# Altium schematic sheet STM32H730_PINOUT.SchDoc
size D; SheetNumber: 5; SheetTotal: 5
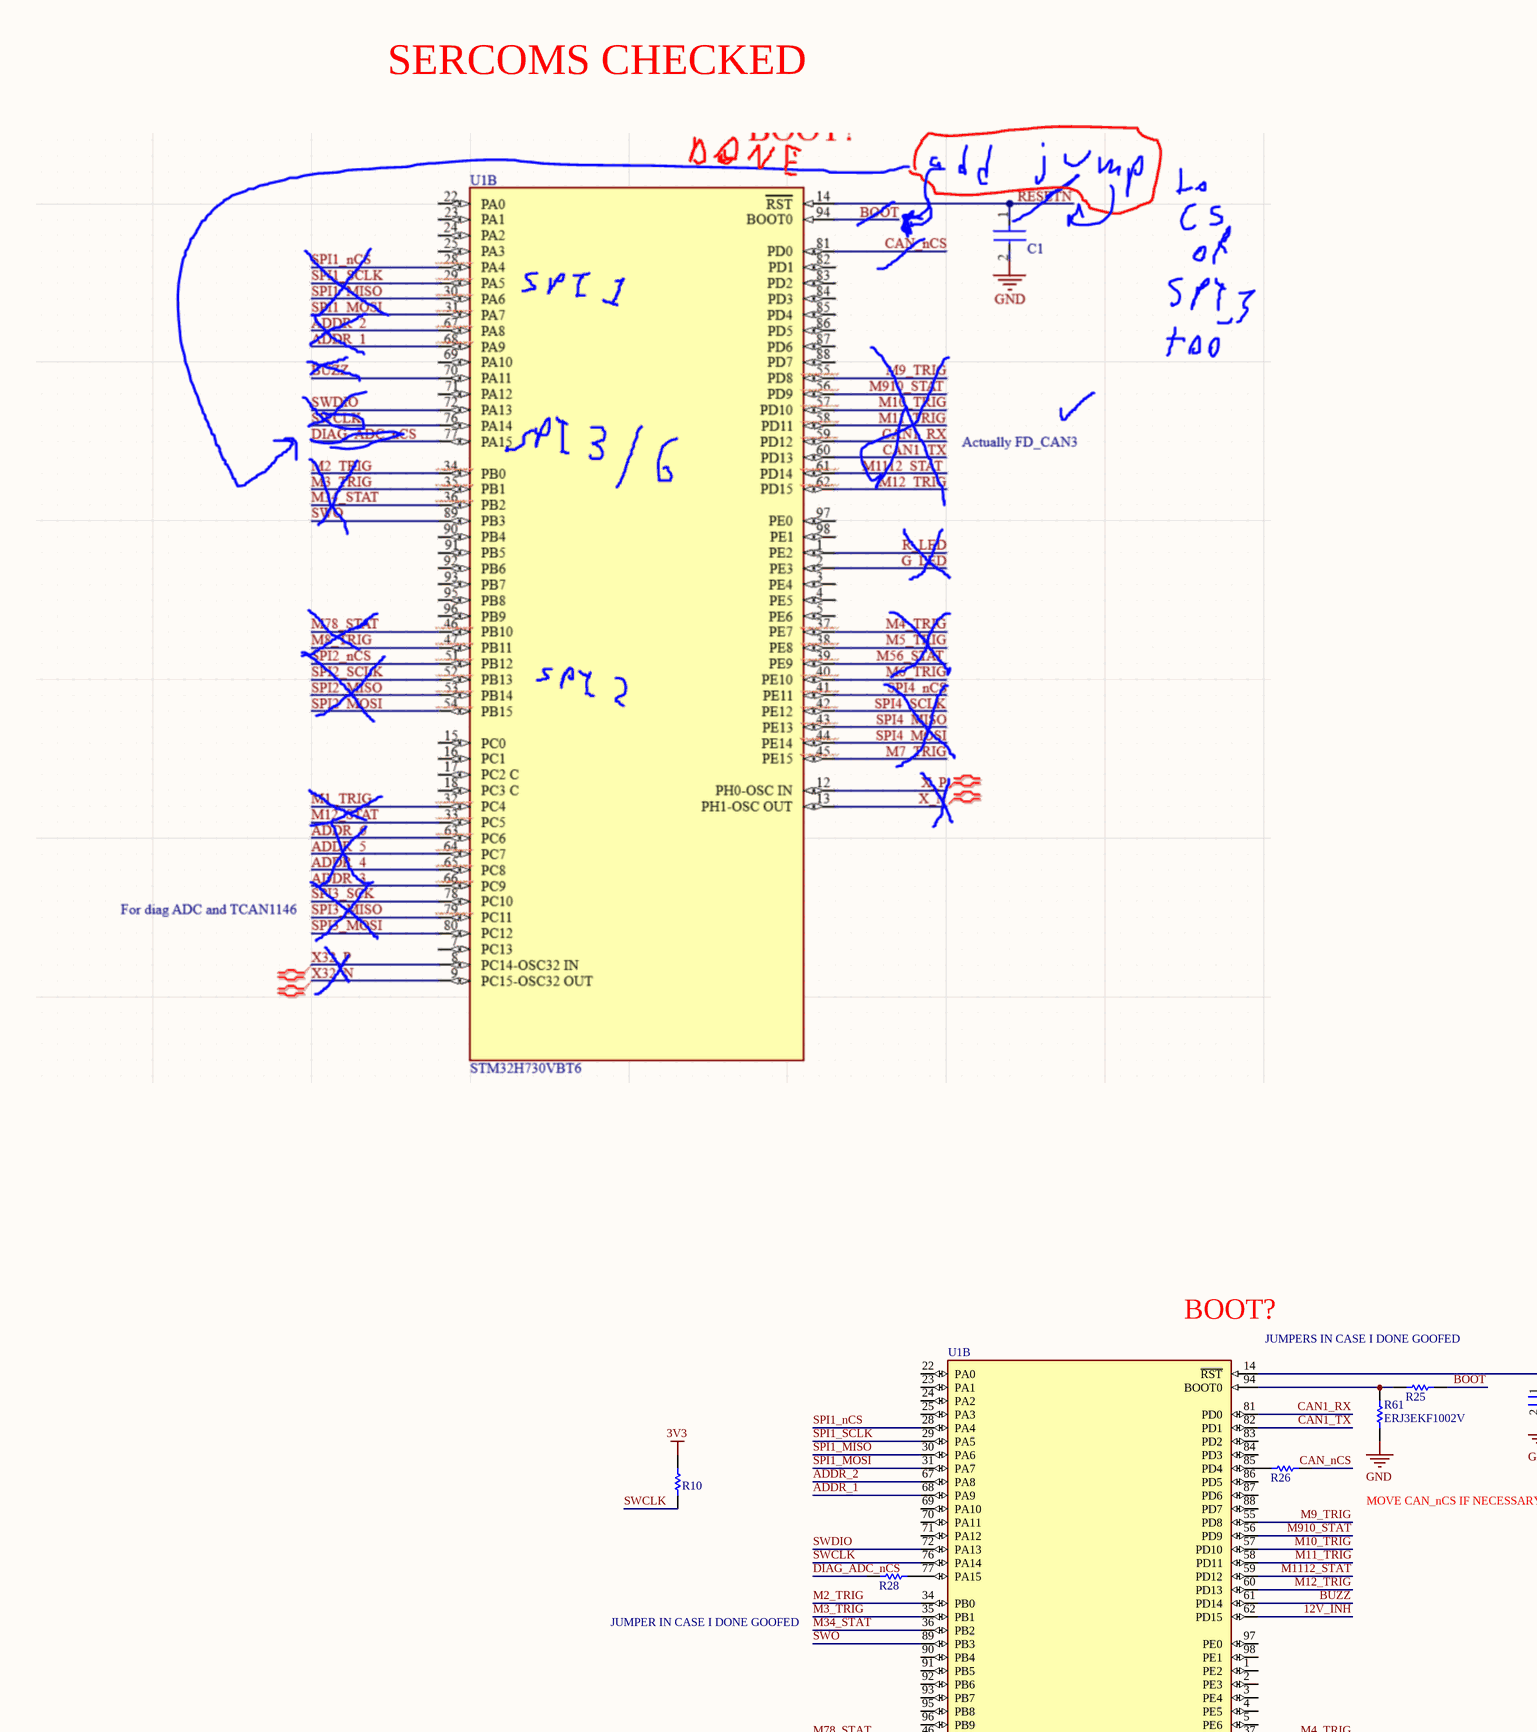
[diagram p0: STM32H730_PINOUT.SchDoc, top left]
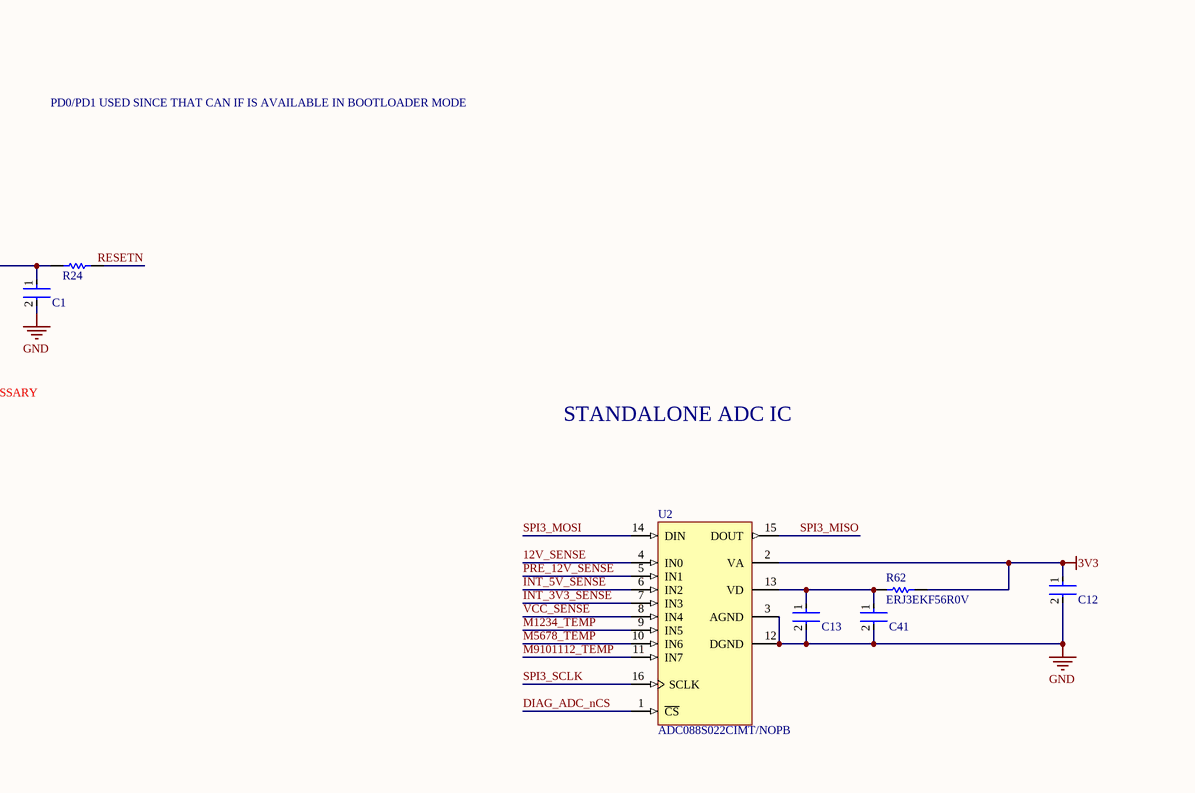
[diagram p1: STM32H730_PINOUT.SchDoc, top middle]
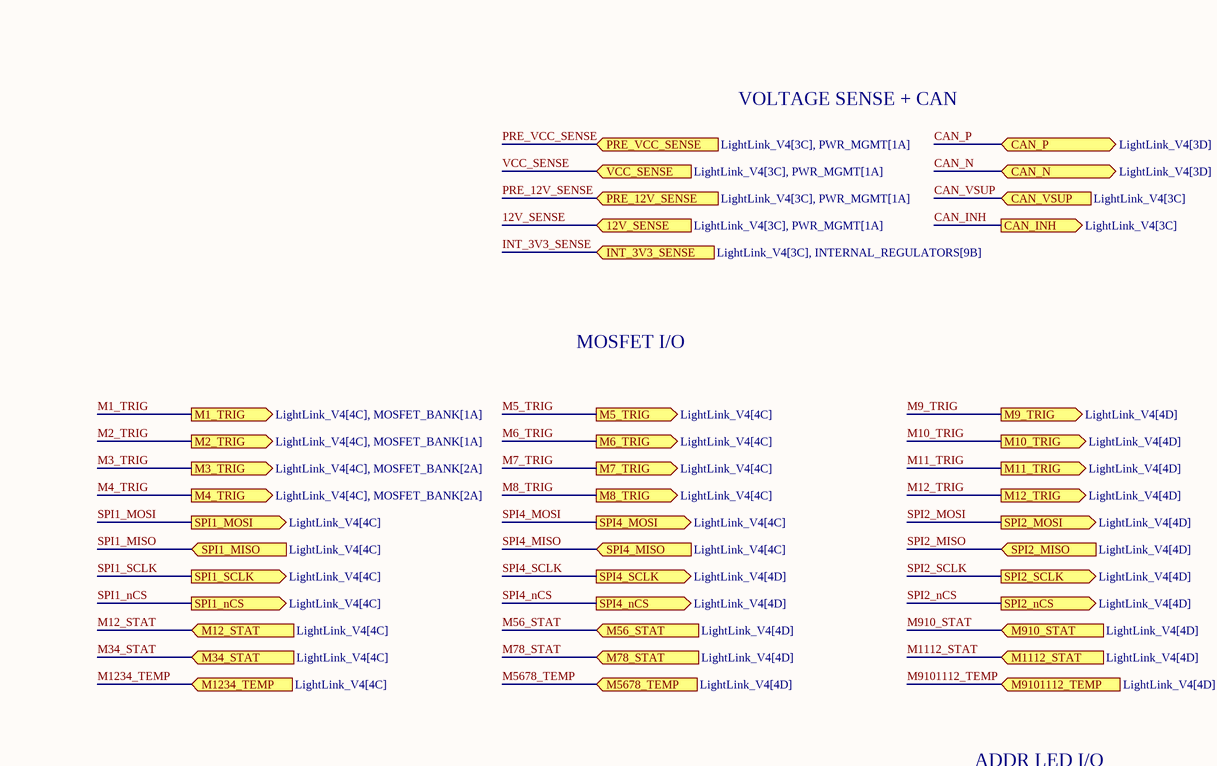
[diagram p2: STM32H730_PINOUT.SchDoc, top right]
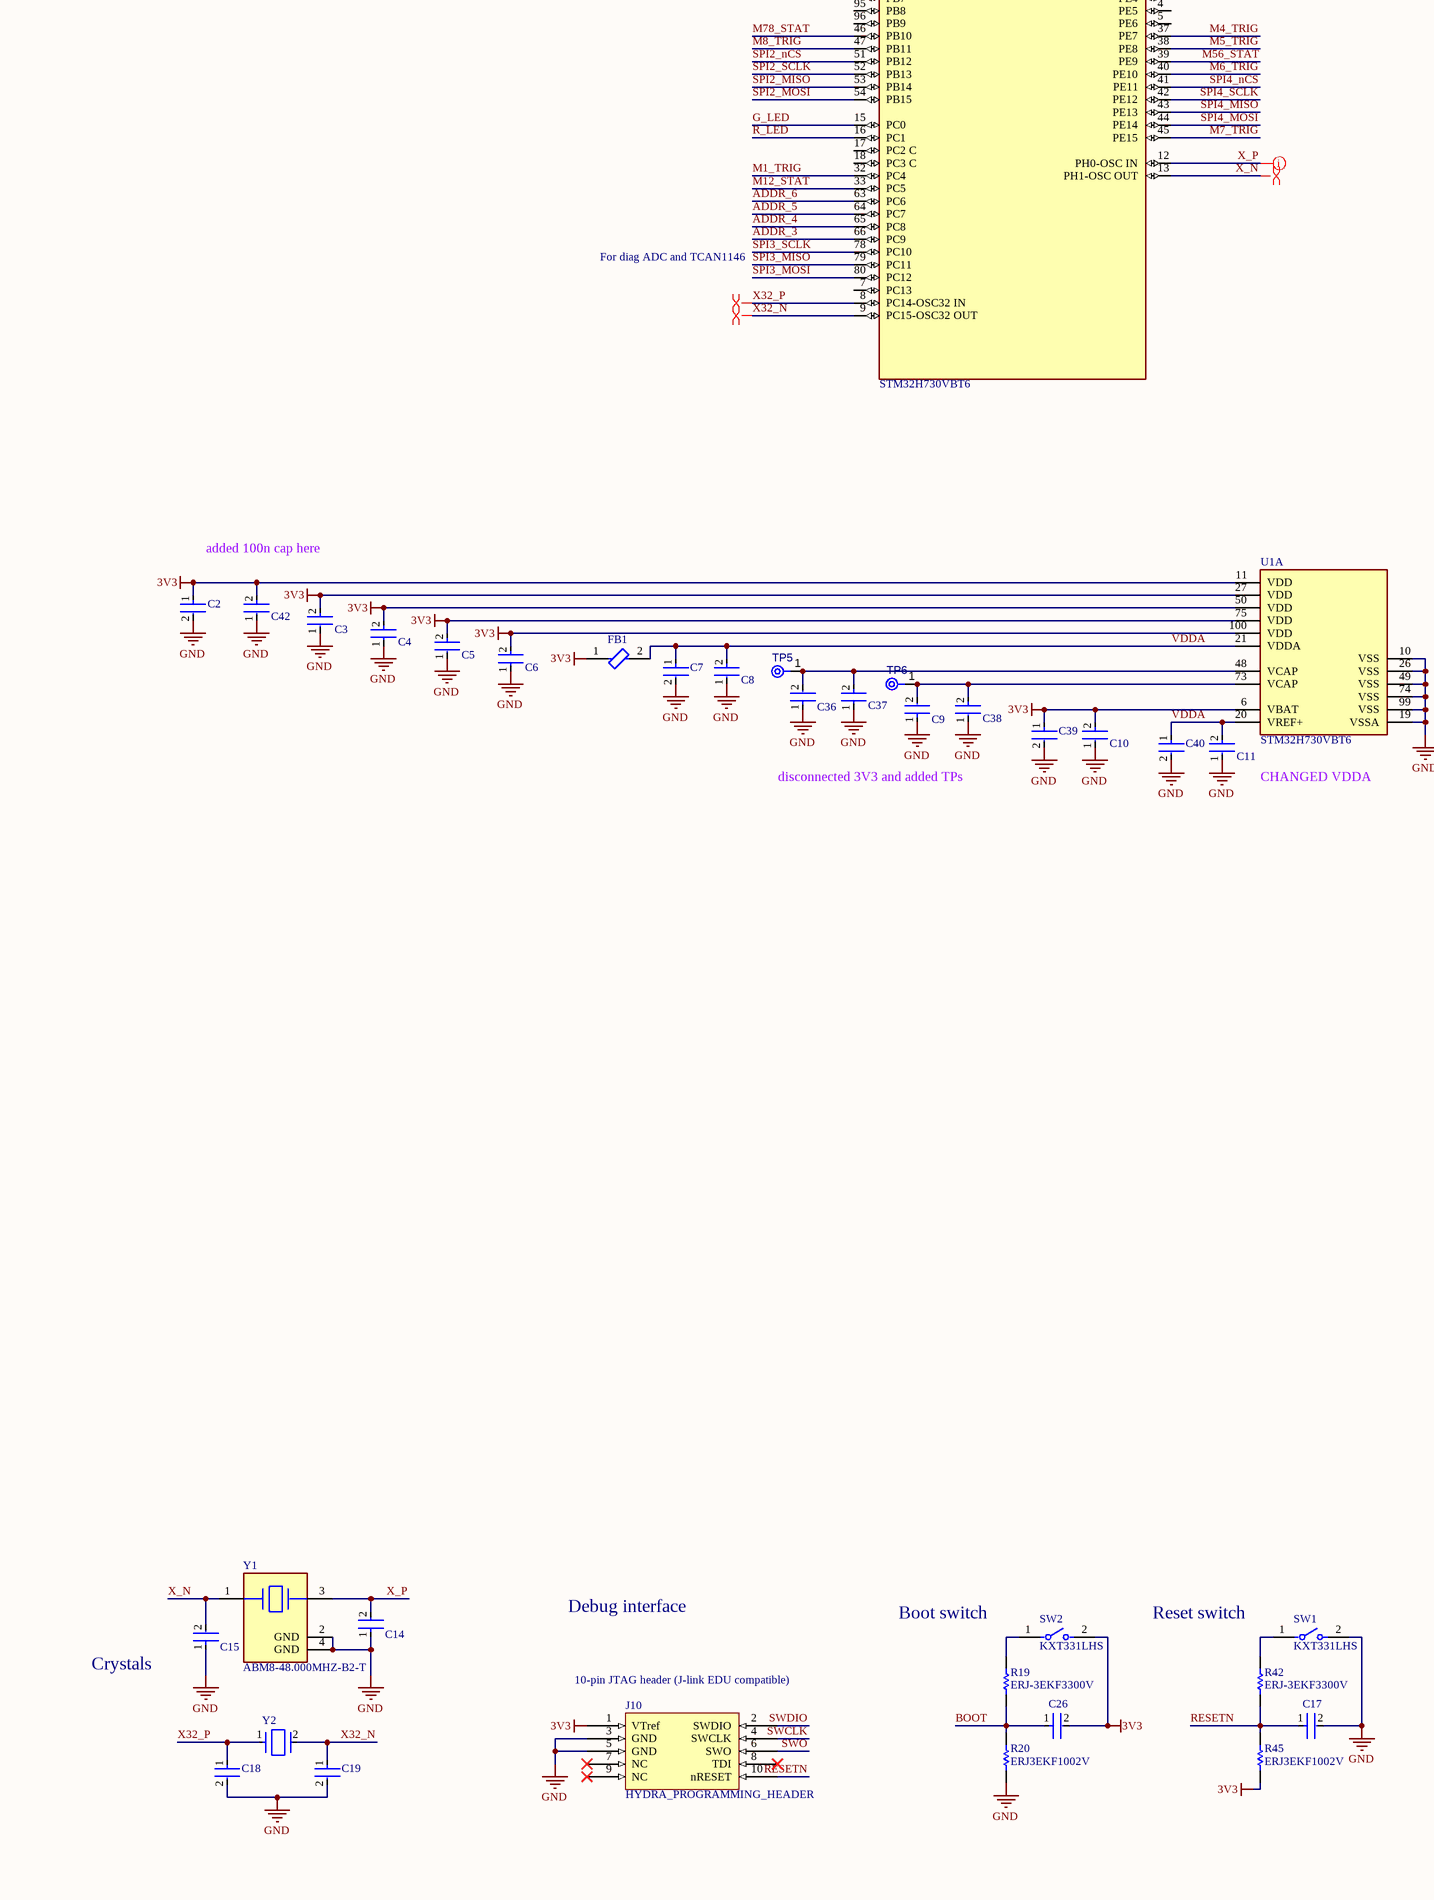
[diagram p3: STM32H730_PINOUT.SchDoc, bottom left]
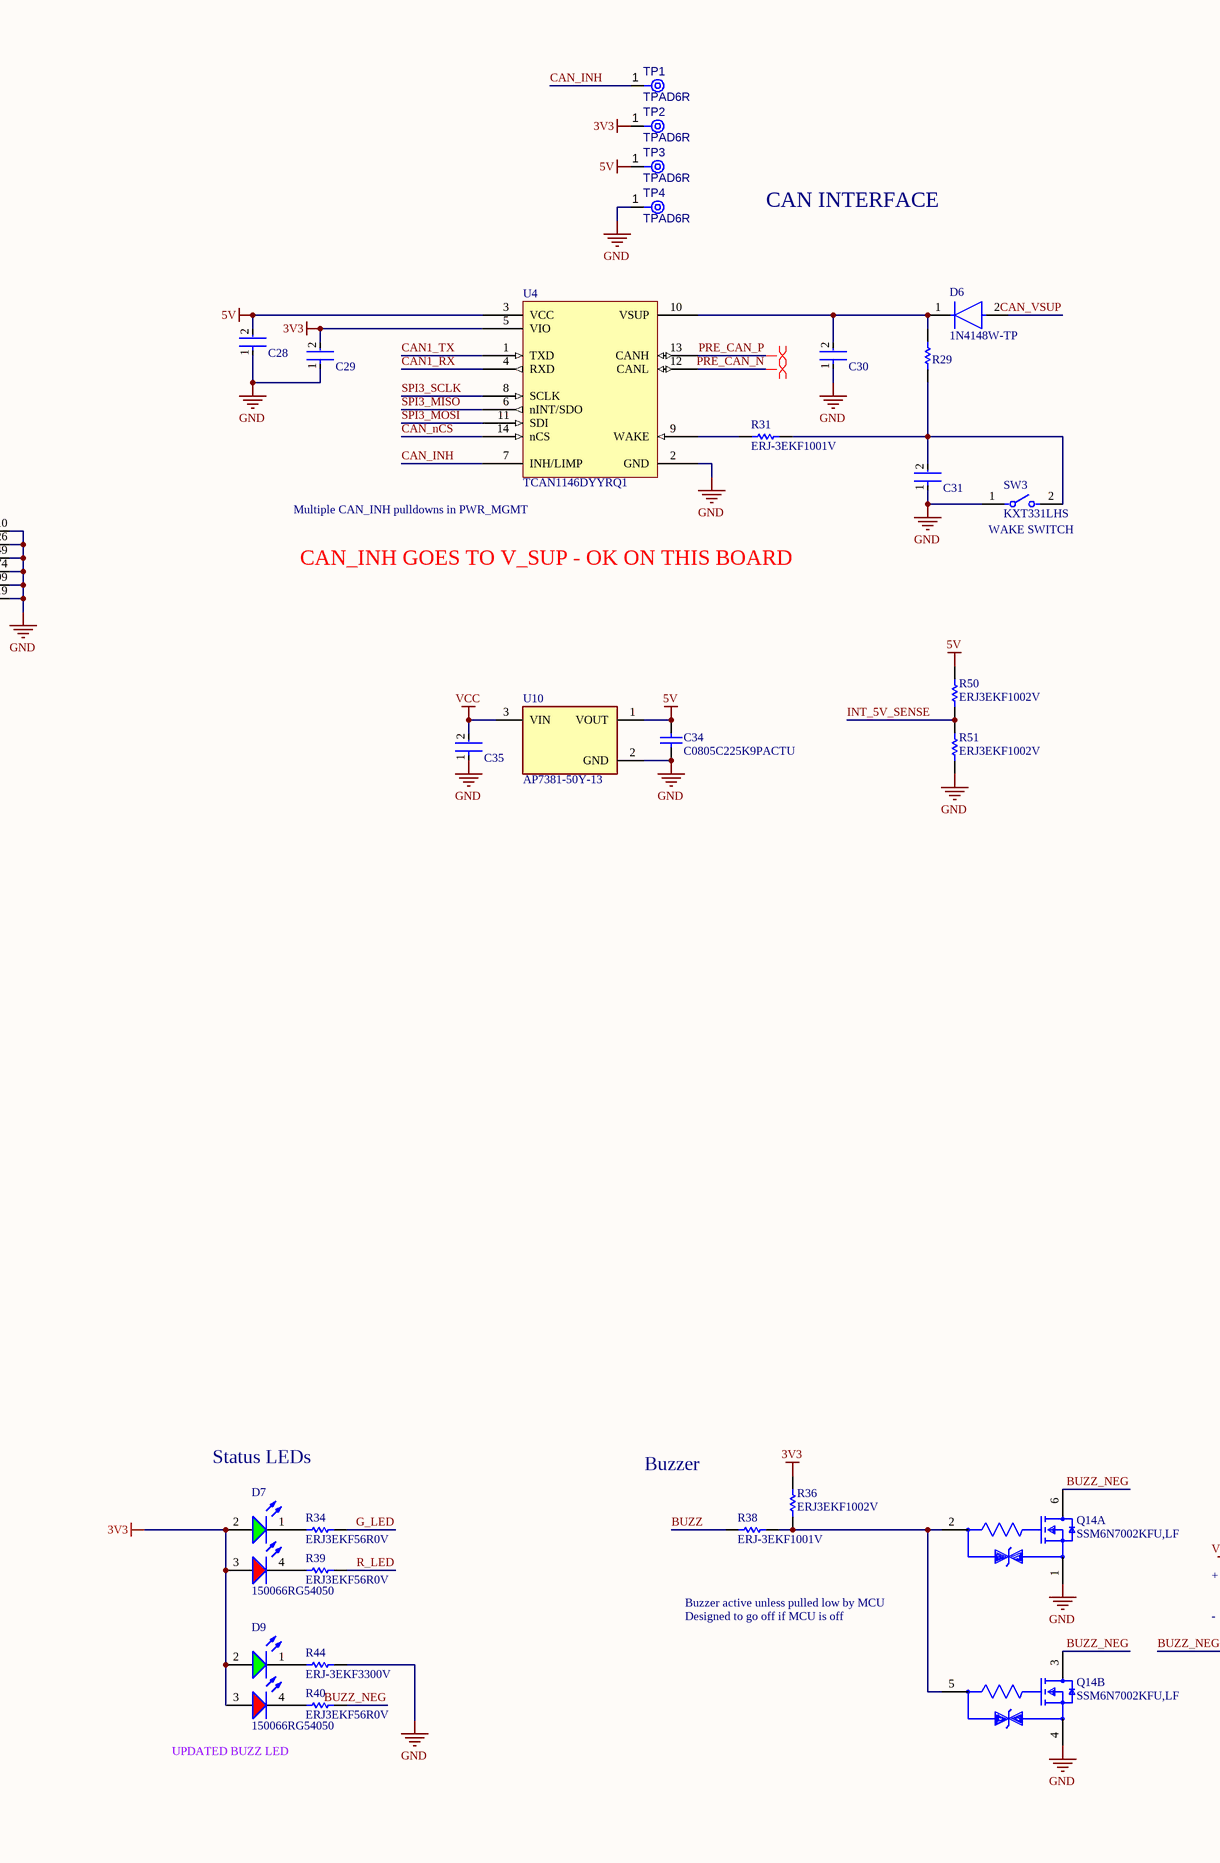
[diagram p4: STM32H730_PINOUT.SchDoc, bottom middle]
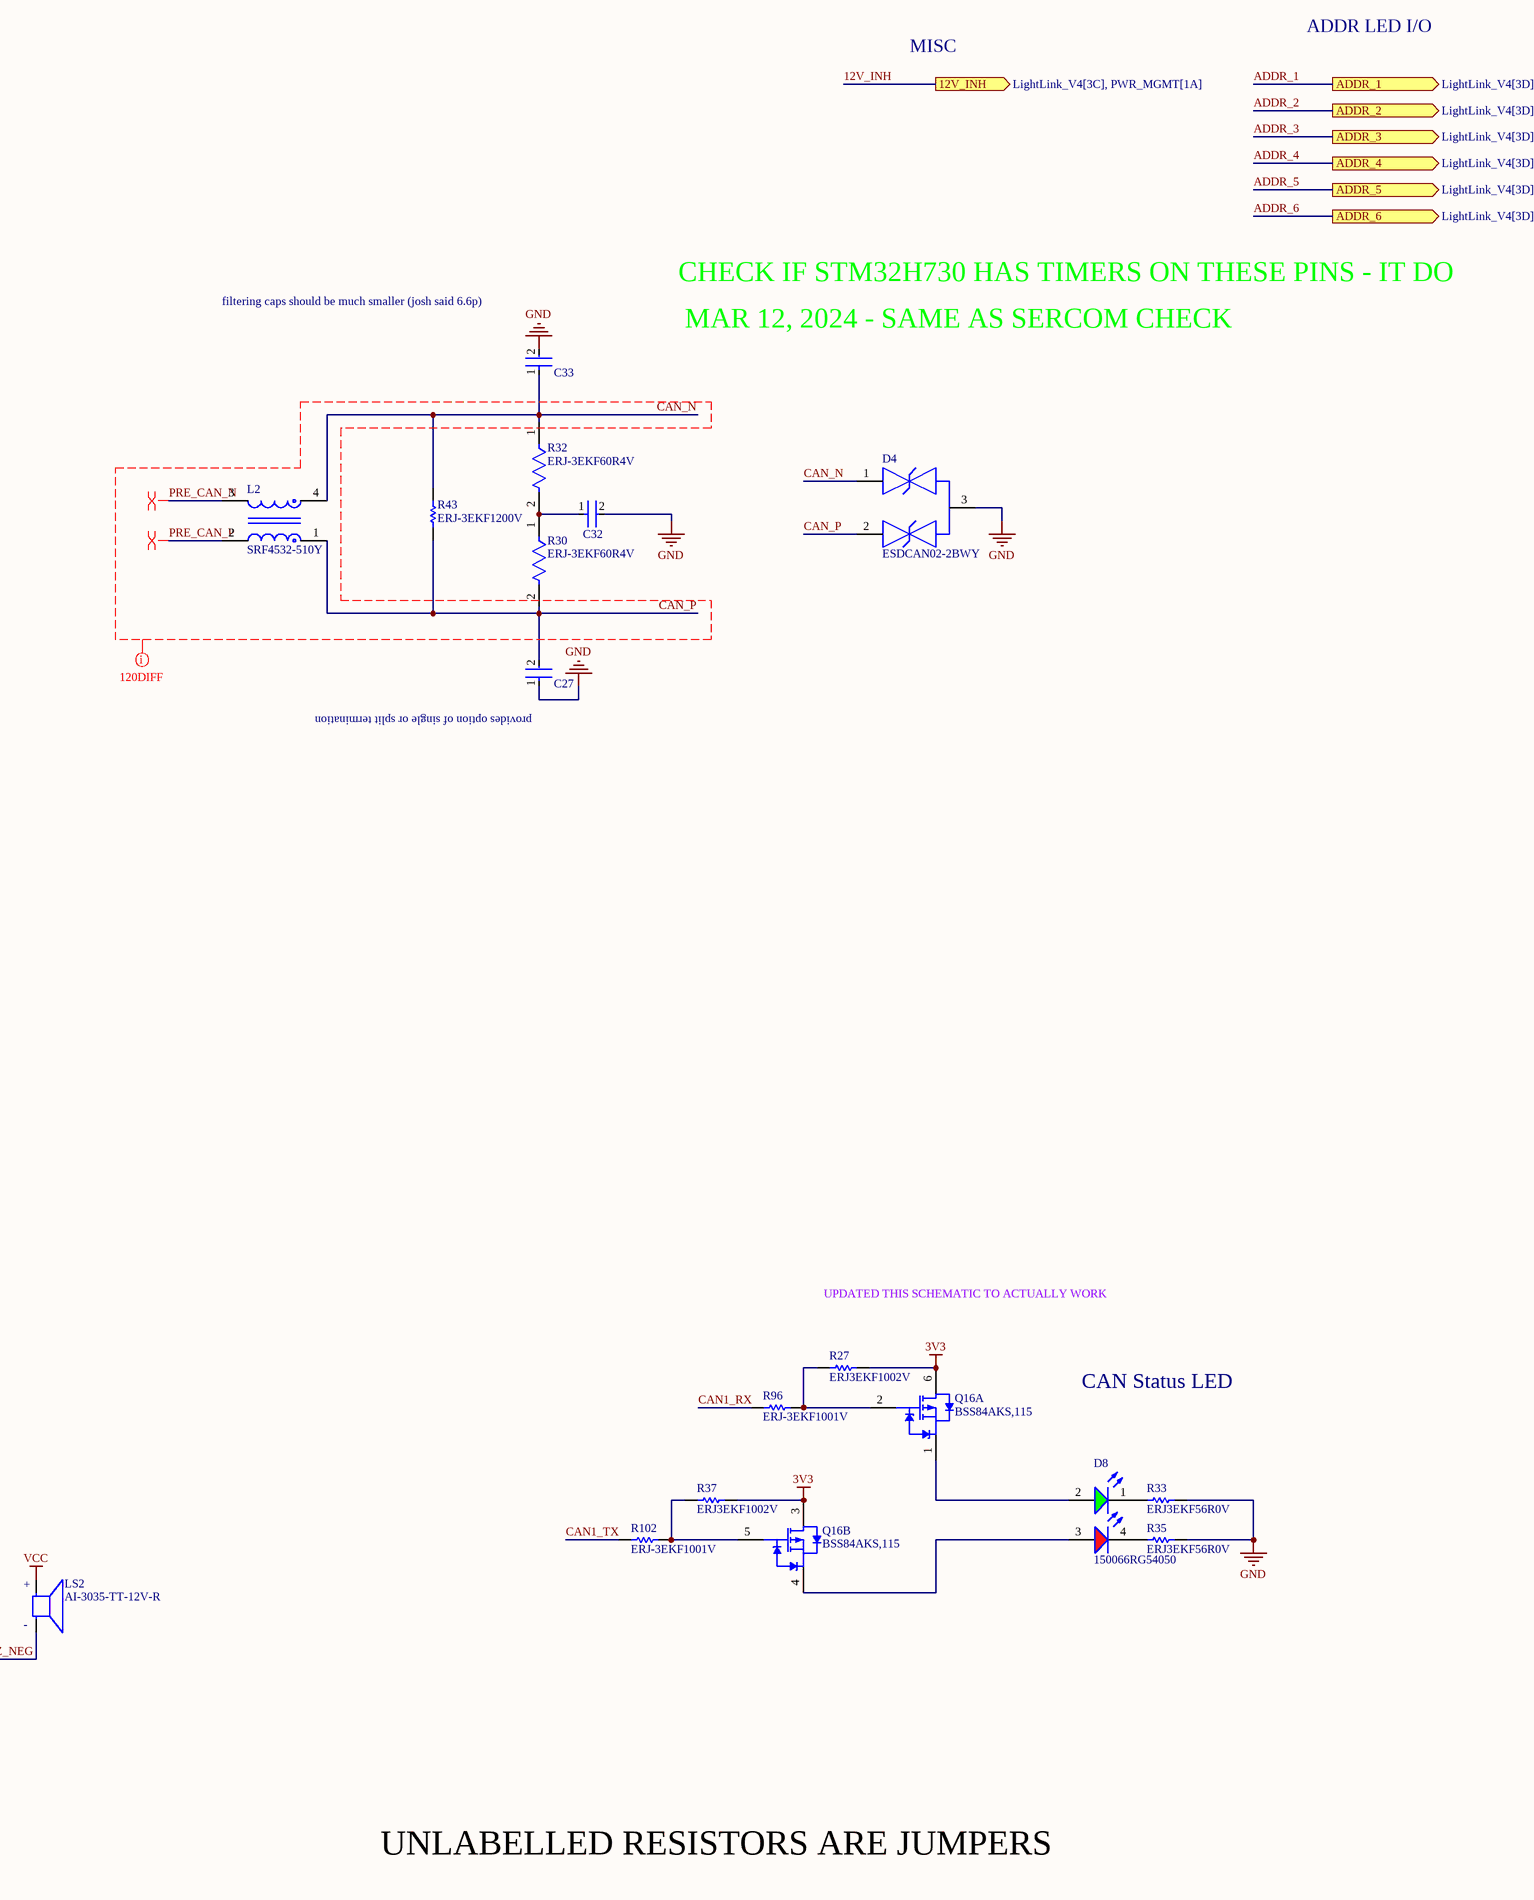
[diagram p5: STM32H730_PINOUT.SchDoc, bottom right]

## Parts
C1  C0402C104K8PACTU  [FP-C0402-BB-MFG]  (value not drawn)
C2  C1005X5R1A475K050BC  [FP-C1005-050-0_15-MFG]  (value not drawn)
C3  GRM155R71C104KA88D  [FP-GRM15-MFG]  (value not drawn)
C4  GRM155R71C104KA88D  [FP-GRM15-MFG]  (value not drawn)
C5  GRM155R71C104KA88D  [FP-GRM15-MFG]  (value not drawn)
C6  GRM155R71C104KA88D  [FP-GRM15-MFG]  (value not drawn)
C7  EMK105BJ105KV-F  [FP-0402-L_1_0_0_05-W_0_5-IPC_A]  (value not drawn)
C8  GRM155R71C104KA88D  [FP-GRM15-MFG]  (value not drawn)
C9  C1005X7S1A225K050BC  [FP-C1005-050-0_15-0_1-MFG]  (value not drawn)
C10  GRM155R71C104KA88D  [FP-GRM15-MFG]  (value not drawn)
C11  GRM155R71C104KA88D  [FP-GRM15-MFG]  (value not drawn)
C12  C0402C104K8PACTU  [FP-C0402-BB-MFG]  (value not drawn)
C13  C0402C104K8PACTU  [FP-C0402-BB-MFG]  (value not drawn)
C14  08051A6R8CAT2A  [FP-0805-L_2_01_0_2-W_1_25-MFG]  (value not drawn)
C15  08051A6R8CAT2A  [FP-0805-L_2_01_0_2-W_1_25-MFG]  (value not drawn)
C17  C0402C104K8PACTU  [FP-C0402-BB-MFG]  (value not drawn)
C18  C0805C180J5GACTU  [FP-C0805C-DN-MFG]  (value not drawn)
C19  C0805C180J5GACTU  [FP-C0805C-DN-MFG]  (value not drawn)
C26  C0402C104K8PACTU  [FP-C0402-BB-MFG]  (value not drawn)
C27  C0402C104K8PACTU  [FP-C0402-BB-MFG]  (value not drawn)
C28  C0402C104K8PACTU  [FP-C0402-BB-MFG]  (value not drawn)
C29  C0402C104K8PACTU  [FP-C0402-BB-MFG]  (value not drawn)
C30  C0402C104K8PACTU  [FP-C0402-BB-MFG]  (value not drawn)
C31  C0402C104K8PACTU  [FP-C0402-BB-MFG]  (value not drawn)
C32  C0402C104K8PACTU  [FP-C0402-BB-MFG]  (value not drawn)
C33  C0402C104K8PACTU  [FP-C0402-BB-MFG]  (value not drawn)
C34  C0805C225K9PACTU  [CAPC2013X145X50ML20T25]
C35  C0402C104K8PACTU  [FP-C0402-BB-MFG]  (value not drawn)
C36  C1005X7S1A225K050BC  [FP-C1005-050-0_15-0_1-MFG]  (value not drawn)
C37  GRM155R71C104KA88D  [FP-GRM15-MFG]  (value not drawn)
C38  GRM155R71C104KA88D  [FP-GRM15-MFG]  (value not drawn)
C39  EMK105BJ105KV-F  [FP-0402-L_1_0_0_05-W_0_5-IPC_A]  (value not drawn)
C40  EMK105BJ105KV-F  [FP-0402-L_1_0_0_05-W_0_5-IPC_A]  (value not drawn)
C41  C0402C104K8PACTU  [FP-C0402-BB-MFG]  (value not drawn)
C42  GRM155R71C104KA88D  [FP-GRM15-MFG]  (value not drawn)
D4  ESDCAN02-2BWY  [FP-SOT323-3L-MFG]
D6  1N4148W-TP  [FP-SOD-123-IPC_A]
D7  150066RG54050  [WL-SBCD_0606]
D8  150066RG54050  [WL-SBCD_0606]
D9  150066RG54050  [WL-SBCD_0606]
FB1  BLM15PX601SN1D  [FP-BLM15-0_05-MFG]  (value not drawn)
J10  HYDRA_PROGRAMMING_HEADER  [3220-10-0300-00-Footprint-1]
L2  SRF4532-510Y  [FP-SRF4532-MFG]
LS2  AI-3035-TT-12V-R  [AI-3035-TT-12V-R-Footprint-1]
Q14  SSM6N7002KFU,LF  [FP-SSOP6-P-0_65A-MFG]  (parts A,B of 2)
Q16  BSS84AKS,115  [NXP-SOT363_L]  (parts A,B of 2)
R10  ERJ3EKF1002V  [RESC1609X55X30LL15T15]  (value not drawn)
R19  ERJ-3EKF3300V  [RESC1608X55X30LL15T15]
R20  ERJ3EKF1002V  [RESC1609X55X30LL15T15]
R24  0402 JUMPER 0 OHM  [RESC1005X40X25NL05T05]  (value not drawn)
R25  0402 JUMPER 0 OHM  [RESC1005X40X25NL05T05]  (value not drawn)
R26  0402 JUMPER 0 OHM  [RESC1005X40X25NL05T05]  (value not drawn)
R27  ERJ3EKF1002V  [RESC1609X55X30LL15T15]
R28  0402 JUMPER 0 OHM  [RESC1005X40X25NL05T05]  (value not drawn)
R29  ERJ3EKF1002V  [RESC1609X55X30LL15T15]  (value not drawn)
R30  ERJ-3EKF60R4V  [FP-ERJ3EK-IPC_C]
R31  ERJ-3EKF1001V  [RESC1608X55X30LL15T15]
R32  ERJ-3EKF60R4V  [FP-ERJ3EK-IPC_C]
R33  ERJ3EKF56R0V  [RESC1608X55X30NL15T15]
R34  ERJ3EKF56R0V  [RESC1608X55X30NL15T15]
R35  ERJ3EKF56R0V  [RESC1608X55X30NL15T15]
R36  ERJ3EKF1002V  [RESC1609X55X30LL15T15]
R37  ERJ3EKF1002V  [RESC1609X55X30LL15T15]
R38  ERJ-3EKF1001V  [RESC1608X55X30LL15T15]
R39  ERJ3EKF56R0V  [RESC1608X55X30NL15T15]
R40  ERJ3EKF56R0V  [RESC1608X55X30NL15T15]
R42  ERJ-3EKF3300V  [RESC1608X55X30LL15T15]
R43  ERJ-3EKF1200V  [RESC1609X55X30ML15T15]
R44  ERJ-3EKF3300V  [RESC1608X55X30LL15T15]
R45  ERJ3EKF1002V  [RESC1609X55X30LL15T15]
R50  ERJ3EKF1002V  [RESC1609X55X30LL15T15]
R51  ERJ3EKF1002V  [RESC1609X55X30LL15T15]
R61  ERJ3EKF1002V  [RESC1609X55X30LL15T15]
R62  ERJ3EKF56R0V  [RESC1608X55X30NL15T15]
R96  ERJ-3EKF1001V  [RESC1608X55X30LL15T15]
R102  ERJ-3EKF1001V  [RESC1608X55X30LL15T15]
SW1  KXT331LHS  [FP-KXT331LHS-MFG]
SW2  KXT331LHS  [FP-KXT331LHS-MFG]
SW3  KXT331LHS  [FP-KXT331LHS-MFG]
TP1  TPAD6R  [TP06R]  (no BOM)
TP2  TPAD6R  [TP06R]  (no BOM)
TP3  TPAD6R  [TP06R]  (no BOM)
TP4  TPAD6R  [TP06R]  (no BOM)
TP5  TPAD6R  [TP06R]  (value not drawn)  (no BOM)
TP6  TPAD6R  [TP06R]  (value not drawn)  (no BOM)
U1  STM32H730VBT6  [FP-LQFP100-1L-IPC_C]  (parts A,B of 2)
U2  ADC088S022CIMT/NOPB  [MTC16_L]
U4  TCAN1146DYYRQ1  [TCAN1146DYYRQ1-Footprint-1]
U10  AP7381-50Y-13  [FP-SOT89-MFG]
Y1  ABM8-48.000MHZ-B2-T  [FP-ABM8-MFG]
Y2  ECS-.327-12.5-1210-TR  [FP-ECX-1210-MFG]  (value not drawn)

## Ports
12V_INH (out, see LightLink_V4[3C], PWR_MGMT[1A]), 12V_SENSE (in, see LightLink_V4[3C], PWR_MGMT[1A]), ADDR_1 (out, see LightLink_V4[3D]), ADDR_2 (out, see LightLink_V4[3D]), ADDR_3 (out, see LightLink_V4[3D]), ADDR_4 (out, see LightLink_V4[3D]), ADDR_5 (out, see LightLink_V4[3D]), ADDR_6 (out, see LightLink_V4[3D]), CAN_INH (out, see LightLink_V4[3C]), CAN_N (bidir, see LightLink_V4[3D]), CAN_P (bidir, see LightLink_V4[3D]), CAN_VSUP (in, see LightLink_V4[3C]), INT_3V3_SENSE (in, see LightLink_V4[3C], INTERNAL_REGULATORS[9B]), M1_TRIG (out, see LightLink_V4[4C], MOSFET_BANK[1A]), M2_TRIG (out, see LightLink_V4[4C], MOSFET_BANK[1A]), M3_TRIG (out, see LightLink_V4[4C], MOSFET_BANK[2A]), M4_TRIG (out, see LightLink_V4[4C], MOSFET_BANK[2A]), M5_TRIG (out, see LightLink_V4[4C]), M6_TRIG (out, see LightLink_V4[4C]), M7_TRIG (out, see LightLink_V4[4C]), M8_TRIG (out, see LightLink_V4[4C]), M9_TRIG (out, see LightLink_V4[4D]), M10_TRIG (out, see LightLink_V4[4D]), M11_TRIG (out, see LightLink_V4[4D]), M12_STAT (in, see LightLink_V4[4C]), M12_TRIG (out, see LightLink_V4[4D]), M34_STAT (in, see LightLink_V4[4C]), M56_STAT (in, see LightLink_V4[4D]), M78_STAT (in, see LightLink_V4[4D]), M910_STAT (in, see LightLink_V4[4D]), M1112_STAT (in, see LightLink_V4[4D]), M1234_TEMP (in, see LightLink_V4[4C]), M5678_TEMP (in, see LightLink_V4[4D]), M9101112_TEMP (in, see LightLink_V4[4D]), PRE_12V_SENSE (in, see LightLink_V4[3C], PWR_MGMT[1A]), PRE_VCC_SENSE (in, see LightLink_V4[3C], PWR_MGMT[1A]), SPI1_MISO (in, see LightLink_V4[4C]), SPI1_MOSI (out, see LightLink_V4[4C]), SPI1_nCS (out, see LightLink_V4[4C]), SPI1_SCLK (out, see LightLink_V4[4C]), SPI2_MISO (in, see LightLink_V4[4D]), SPI2_MOSI (out, see LightLink_V4[4D]), SPI2_nCS (out, see LightLink_V4[4D]), SPI2_SCLK (out, see LightLink_V4[4D]), SPI4_MISO (in, see LightLink_V4[4C]), SPI4_MOSI (out, see LightLink_V4[4C]), SPI4_nCS (out, see LightLink_V4[4D]), SPI4_SCLK (out, see LightLink_V4[4D]), VCC_SENSE (in, see LightLink_V4[3C], PWR_MGMT[1A])

## Nets
3V3: C2.1 C3.2 C4.2 C5.2 C6.2 C10.2 C12.1 C26.2 C29.2 C39.1 C42.2 D7.2(A) D7.3(A) D9.2(A) D9.3(A) FB1.1 J10.1(VTref) Q16.3(D2) Q16.6(D1) R10.1 R27.2 R36.2 R37.2 R45.1 R62.1 SW2.2 TP2.1(TP) U1.6(VBAT) U1.11(VDD) U1.27(VDD) U1.50(VDD) U1.75(VDD) U1.100(VDD) U2.2(VA) U4.5(VIO)
5V: C28.2 C34.2 R50.2 TP3.1(TP) U4.3(VCC) U10.1(VOUT)
GND: C1.2 C2.2 C3.1 C4.1 C5.1 C6.1 C7.2 C8.1 C9.1 C10.1 C11.1 C12.2 C13.2 C14.1 C15.1 C17.2 C18.2 C19.2 C27.1 C28.1 C29.1 C30.1 C31.1 C32.2 C33.2 C34.1 C35.1 C36.1 C37.1 C38.1 C39.2 C40.2 C41.2 C42.1 D4.3 J10.3(GND) J10.5(GND) Q14.1(Source1) Q14.4(Source2) R20.1 R33.1 R35.1 R44.2 R51.2 R61.1 SW1.2 SW3.1 TP4.1(TP) U1.10(VSS) U1.19(VSSA) U1.26(VSS) U1.49(VSS) U1.74(VSS) U1.99(VSS) U2.3(AGND) U2.12(DGND) U4.2(GND) U10.2(GND) Y1.2(GND) Y1.4(GND)
VCC: C35.2 LS2.P U10.3(VIN)
12V_INH: U1.62(PD15) ; port 12V_INH
12V_SENSE: U2.4(IN0) ; port 12V_SENSE
ADDR_1: U1.68(PA9) ; port ADDR_1
ADDR_2: U1.67(PA8) ; port ADDR_2
ADDR_3: U1.66(PC9) ; port ADDR_3
ADDR_4: U1.65(PC8) ; port ADDR_4
ADDR_5: U1.64(PC7) ; port ADDR_5
ADDR_6: U1.63(PC6) ; port ADDR_6
BOOT: C26.1 R19.1 R20.2 R25.2
BUZZ: R38.1 U1.61(PD14)
BUZZ_NEG: LS2.N Q14.3(Drain2) Q14.6(Drain1) R40.1
CAN1_RX: R96.1 U1.81(PD0) U4.4(RXD)
CAN1_TX: R102.1 U1.82(PD1) U4.1(TXD)
CAN_INH: TP1.1(TP) U4.7(INH/LIMP) ; port CAN_INH
CAN_N: C33.1 D4.1 L2.4 R32.1 R43.1 ; port CAN_N
CAN_nCS: R26.2 U4.14(nCS)
CAN_P: C27.2 D4.2 L2.1 R30.2 R43.2 ; port CAN_P
CAN_VSUP: D6.2(A) ; port CAN_VSUP
DIAG_ADC_nCS: R28.1 U2.1(~{CS})
G_LED: R34.1 U1.15(PC0)
INT_3V3_SENSE: U2.7(IN3) ; port INT_3V3_SENSE
INT_5V_SENSE: R50.1 R51.1 U2.6(IN2)
M1_TRIG: U1.32(PC4) ; port M1_TRIG
M2_TRIG: U1.34(PB0) ; port M2_TRIG
M3_TRIG: U1.35(PB1) ; port M3_TRIG
M4_TRIG: U1.37(PE7) ; port M4_TRIG
M5_TRIG: U1.38(PE8) ; port M5_TRIG
M6_TRIG: U1.40(PE10) ; port M6_TRIG
M7_TRIG: U1.45(PE15) ; port M7_TRIG
M8_TRIG: U1.47(PB11) ; port M8_TRIG
M9_TRIG: U1.55(PD8) ; port M9_TRIG
M10_TRIG: U1.57(PD10) ; port M10_TRIG
M11_TRIG: U1.58(PD11) ; port M11_TRIG
M12_STAT: U1.33(PC5) ; port M12_STAT
M12_TRIG: U1.60(PD13) ; port M12_TRIG
M34_STAT: U1.36(PB2) ; port M34_STAT
M56_STAT: U1.39(PE9) ; port M56_STAT
M78_STAT: U1.46(PB10) ; port M78_STAT
M910_STAT: U1.56(PD9) ; port M910_STAT
M1112_STAT: U1.59(PD12) ; port M1112_STAT
M1234_TEMP: U2.9(IN5) ; port M1234_TEMP
M5678_TEMP: U2.10(IN6) ; port M5678_TEMP
M9101112_TEMP: U2.11(IN7) ; port M9101112_TEMP
PRE_12V_SENSE: U2.5(IN1) ; port PRE_12V_SENSE
PRE_CAN_N: L2.3 U4.12(CANL)
PRE_CAN_P: L2.2 U4.13(CANH)
PRE_VCC_SENSE: port PRE_VCC_SENSE
R_LED: R39.1 U1.16(PC1)
RESETN: C17.1 J10.10(nRESET) R24.2 R42.1 R45.2
SPI1_MISO: U1.30(PA6) ; port SPI1_MISO
SPI1_MOSI: U1.31(PA7) ; port SPI1_MOSI
SPI1_nCS: U1.28(PA4) ; port SPI1_nCS
SPI1_SCLK: U1.29(PA5) ; port SPI1_SCLK
SPI2_MISO: U1.53(PB14) ; port SPI2_MISO
SPI2_MOSI: U1.54(PB15) ; port SPI2_MOSI
SPI2_nCS: U1.51(PB12) ; port SPI2_nCS
SPI2_SCLK: U1.52(PB13) ; port SPI2_SCLK
SPI3_MISO: U1.79(PC11) U2.15(DOUT) U4.6(nINT/SDO)
SPI3_MOSI: U1.80(PC12) U2.14(DIN) U4.11(SDI)
SPI3_SCLK: U1.78(PC10) U2.16(SCLK) U4.8(SCLK)
SPI4_MISO: U1.43(PE13) ; port SPI4_MISO
SPI4_MOSI: U1.44(PE14) ; port SPI4_MOSI
SPI4_nCS: U1.41(PE11) ; port SPI4_nCS
SPI4_SCLK: U1.42(PE12) ; port SPI4_SCLK
SWCLK: J10.4(SWCLK) R10.2 U1.76(PA14)
SWDIO: J10.2(SWDIO) U1.72(PA13)
SWO: J10.6(SWO) U1.89(PB3)
VCC_SENSE: U2.8(IN4) ; port VCC_SENSE
VDDA: C7.1 C8.2 C11.2 C40.1 FB1.2 U1.20(VREF+) U1.21(VDDA)
X32_N: C19.1 U1.9(PC15-OSC32_OUT) Y2.2(Out/In)
X32_P: C18.1 U1.8(PC14-OSC32_IN) Y2.1(In/Out)
X_N: C15.2 U1.13(PH1-OSC_OUT) Y1.1
X_P: C14.2 U1.12(PH0-OSC_IN) Y1.3
NetC1_1: C1.1 R24.1 U1.14(~{RST})
NetC9_2: C9.2 C38.2 TP6.1(TP) U1.73(VCAP)
NetC13_1: C13.1 C41.1 R62.2 U2.13(VD)
NetC30_2: C30.2 D6.1(C) R29.1 U4.10(VSUP)
NetC31_2: C31.2 R29.2 R31.2 SW3.2
NetC32_1: C32.1 R30.1 R32.2
NetC36_2: C36.2 C37.2 TP5.1(TP) U1.48(VCAP)
NetD7_1: D7.1(K) R34.2
NetD7_4: D7.4(K) R39.2
NetD8_1: D8.1(K) R33.2
NetD8_2: D8.2(A) Q16.1(S1)
NetD8_3: D8.3(A) Q16.4(S2)
NetD8_4: D8.4(K) R35.2
NetD9_1: D9.1(K) R44.1
NetD9_4: D9.4(K) R40.2
NetQ14_2: Q14.2(Gate1) Q14.5(Gate2) R36.1 R38.2
NetQ16_2: Q16.2(G1) R27.1 R96.2
NetQ16_5: Q16.5(G2) R37.1 R102.2
NetR19_2: R19.2 SW2.1
NetR25_1: R25.1 R61.2 U1.94(BOOT0)
NetR26_1: R26.1 U1.85(PD4)
NetR28_2: R28.2 U1.77(PA15)
NetR31_1: R31.1 U4.9(WAKE)
NetR42_2: R42.2 SW1.1

Not connected (* = marked no-connect by the designer): J10 7(NC)* 8(TDI)* 9(NC)*; U1 1(PE2) 2(PE3) 3(PE4) 4(PE5) 5(PE6) 7(PC13) 17(PC2_C) 18(PC3_C) 22(PA0) 23(PA1) 24(PA2) 25(PA3) 69(PA10) 70(PA11) 71(PA12) 83(PD2) 84(PD3) 86(PD5) 87(PD6) 88(PD7) 90(PB4) 91(PB5) 92(PB6) 93(PB7) 95(PB8) 96(PB9) 97(PE0) 98(PE1)

## Layout directives
differential pair: PRE_CAN_N, PRE_CAN_P, X32_N, X32_P, X_N, X_P
net class 120DIFF: CAN_N, CAN_P, PRE_CAN_N, PRE_CAN_P

## Notes on the sheet
- SERCOMS CHECKED
- PD0/PD1 USED SINCE THAT CAN IF IS AVAILABLE IN BOOTLOADER MODE
- VOLTAGE SENSE + CAN
- (near U1) BOOT?
- JUMPERS IN CASE I DONE GOOFED
- MOSFET I/O
- MOVE CAN_nCS IF NECESSARY
- STANDALONE ADC IC
- JUMPER IN CASE I DONE GOOFED
- ADDR LED I/O
- MISC
- For diag ADC and TCAN1146
- CAN INTERFACE
- (near C33) filtering caps should be much smaller (josh said 6.6p)
- CHECK IF STM32H730 HAS TIMERS ON THESE PINS - IT DO
- MAR 12, 2024 - SAME AS SERCOM CHECK
- added 100n cap here
- (near U4) Multiple CAN_INH pulldowns in PWR_MGMT
- (near SW3) WAKE SWITCH
- CAN_INH GOES TO V_SUP - OK ON THIS BOARD
- disconnected 3V3 and added TPs
- CHANGED VDDA
- (near C27) provides option of single or split termination
- UPDATED THIS SCHEMATIC TO ACTUALLY WORK
- CAN Status LED
- Status LEDs
- Buzzer
- Debug interface
- Boot switch
- Reset switch
- (near C15) Crystals
- (near J10) 10-pin JTAG header (J-link EDU compatible)
- Buzzer active unless pulled low by MCU
- Designed to go off if MCU is off
- UPDATED BUZZ LED
- UNLABELLED RESISTORS ARE JUMPERS
- (in symbol CMP-00027-00003-1) +; -

## Library data of the parts
C1 C12 C13 C17 C26-C33 C35 C41 = CMP-2008-02046-2: CAP CER 0.1UF 10V X5R 0402; Manufacturer: Kemet; Material: Ceramic; Capacitance: 0.10 μF; Temperature Coefficient: 15%; Tolerance: 0.1; Value: 0.10 μF; Package: C0402-BB; Temperature: -55°C to +125°C; ComponentLink2Description: Datasheet; Temperature Characteristic: X5R; Device Class L1: Passive Components; Height: 0.55mm; Lead Free: Yes; ComponentLink2URL: https://content.kemet.com/datasheets/KEM_C1002_X7R_SMD.pdf; Device Class L2: Capacitors; Temperature Range Low: -55°C; Temperature Range High: +125°C; RoHS: TRUE; Octopart: https://octopart.com/c0402c104k8pactu-kemet-140039; Automotive: No; Mouser Description: Capacitor 100 nF 10 VDC 0402; Category: Cap; Voltage Rating: 10 V; Digikey Description: CAP CER 0.1UF 10V X5R 0402; Ipc Land Pattern Name: CAPC10050X50; Device Class L3: Ceramic Capacitors; Manufacturer Part Number: C0402C104K8PACTU
C2 = CMP-2000-05997-2: CAP CER 4.7UF 10V X5R 0402; Dielectric Material: Ceramic; Tolerance: 10%; Series: C; Package Quantity: 10000; Max Operating Temperature: 85°C; Case Code (Imperial): 0402; Lead Free: Lead Free; Voltage Rating (DC): 10V; Packaging: Cut Tape; Voltage Rating: 10V; Min Operating Temperature: -55°C; Dielectric: X5R; Thickness: 0.022inch; Width: 0.02inch; Case/Package: 0402; Case Code (Metric): 1005; Capacitance: 4.7uF; Length: 0.039inch; RoHS Compliant: Yes; REACH SVHC: No SVHC; Mount: Surface Mount
C3-C6 C8 C10 C11 C37 C38 C42 = CMP-2100-03641-2: CAP CER 0.1UF 16V X7R 0402; Manufacturer: Murata; Standoff Height: 0mm; Tolerance: 10%; Voltage Rating: 16Vdc; Material: Ceramic; Capacitance: 0.10μF; Value: 0.10μF; RoHS: TRUE; Manufacturer Part Number: GRM155R71C104KA88D; Temperature Characteristic: X7R; Octopart: https://octopart.com/grm155r71c104ka88d-murata-196880; Digikey Description: CAP CER 0.1UF 16V X7R 0402; Device Class L3: Ceramic Capacitors; Height: 0.55mm; ComponentLink2Description: Datasheet; Temperature Range Low: -55°C; Ipc Land Pattern Name: CAPC10050X219; ComponentLink2URL: https://search.murata.co.jp/Ceramy/image/img/A01X/G101/ENG/GRM155R71H471KA01-01A.pdf; Device Class L1: Passive Components; Lead Free: yes; Category: Cap; Package: GRM15; Temperature: -55°C to +125°C; Device Class L2: Capacitors; Temperature Range High: +125°C; Mouser Description: 0402 0.1 uF 16V ±10 % Tolerance X7R SMT Multilayer Ceramic Capacitor
C7 C39 C40 = CMP-14477-000104-2: None; Tolerance: 10%; Voltage Rating: 16V; Dielectric: X5R; Capacitance: 1uF; Packaging: Tape and Reel; Depth: 0.5mm; Mount: Surface Mount; Thickness: 0.022inch; Package Quantity: 1; Min Operating Temperature: -55°C; Series: M; Voltage Rating (DC): 16V; Termination: SMD/SMT; Case/Package: 0402; Number of Pins: 2; Case Code (Imperial): 0402; Length: 1mm; Halogen Free: Halogen Free; Case Code (Metric): 1005; Width: 0.02inch; RoHS Compliant: Yes; Radiation Hardening: No; Max Operating Temperature: 85°C; Height: 0.5mm; Construction: Flat
C9 C36 = CMP-08246-004344-1: CAP CER 2.2UF 10V X7S 0402; Dielectric Material: Ceramic; Tolerance: 10%; Mount: Surface Mount; Height: 0.5mm; Package Quantity: 1; Depth: 0.5mm; RoHS Compliant: Yes; Length: 1mm; Thickness: 0.022inch; Packaging: Tape and Reel; Capacitance: 2.2uF; Case Code (Imperial): 0402; Resistor Type: Ceramic; Dielectric: X7S; Case/Package: 0402; Min Operating Temperature: -55°C; Voltage Rating: 10V; Series: C; Weight: 2.3E-05oz; Width: 0.02inch; Voltage Rating (DC): 10V; Case Code (Metric): 1005; Max Operating Temperature: 125°C; Termination: SMD/SMT; Lead Free: Lead Free
C14 C15 = CMP-1036-00709-3: General Purpose Ceramic Capacitor, 0805, 6.8pF, 0.25pF, C0G, 30ppm/°C, 100V; Dissipation Factor: 10%; Insulation Resistance: 100GR; Tolerance: 5%; Max Operating Temperature: 125°C; RoHS Compliant: Yes; Capacitance: 6.8pF; Termination: SMD/SMT; Number of Pins: 2; Packaging: Tape and Reel; Mount: Surface Mount; Case Code (Metric): 2012; Case Code (Imperial): 0805; Height: 0.71mm; Min Operating Temperature: -55°C; Width: 0.049inch; Temperature Coefficient: 0ppm/°C; Length: 2.01mm; Dielectric: C0G; Series: -; Voltage Rating (DC): 100V; Dielectric Material: Ceramic; Depth: 1.25mm; Contact Plating: Tin; Voltage Rating: 100V; Thickness: 0.037inch; Case/Package: 0805; Lead Free: Lead Free; Radiation Hardening: No; Voltage: 100V; Construction: Flat; Package Quantity: 1; REACH SVHC: No SVHC
C18 C19 = CMP-2007-00302-2: CAP CER 18PF 50V C0G/NP0 0805; Manufacturer: KEMET; Temperature Characteristic: C0G; Tolerance: 0.05; Material: Ceramic; Temperature Coefficient: 30ppm/°C; Device Class L2: Capacitors; Capacitance: 18 pF; Temperature: -55°C to +125°C; Value: 18 pF; Package: C0805C-DN; Mouser Description: Cap Ceramic 18pF 50V C0G 5% SMD 0805 125C Paper T/R; Height: 0.88mm; ComponentLink2URL: https://content.kemet.com/datasheets/KEM_C1003_C0G_SMD.pdf; RoHS: TRUE; Octopart: https://octopart.com/c0805c180j5gactu-kemet-144810; ComponentLink2Description: Datasheet; Temperature Range High: +125°C; Digikey Description: CAP CER 18PF 50V C0G/NP0 0805; Device Class L1: Passive Components; Category: Cap; Automotive: No; Device Class L3: Ceramic Capacitors; Voltage Rating: 50 V; Temperature Range Low: -55°C; Ipc Land Pattern Name: CAPC200125X78; Lead Free: Yes; Manufacturer Part Number: C0805C180J5GACTU
C34 = CMP-1036-04819-2: Manufacturer: Kemet; Part Number: C0805C225K9PACTU
D4 = CMP-12225-000055-1: TVS DIODE 26.5V 44V SOT323-3; Manufacturer: STMicroelectronics; Value: 3pF; Direction: Bidirectional; Breakdown Voltage: 28.5V; Automotive Grade: Grade 0; Standoff Height: 0mm; Peak Pulse Power: 170W; Peak Pulse Current: 3A; Number Of Channels: 2; Max Junction Temp: +175°C; Mouser Description: TVS Diodes / ESD Suppressors Automotive dual-line Transil, Transient voltage suppressor (TVS) for CAN bus; Height: 1.1mm; Category: Diode; Reverse Standoff Voltage: 26.5V; Device Class L1: Circuit Protection; Temperature: -55°C to +175°C; RoHS: TRUE; ComponentLink2URL: https://www.st.com/resource/en/datasheet/esdcan02-2bwy.pdf; Device Class L3: unset; Device Class L2: TVS Diodes; Temperature Range High: +175°C; Octopart: https://octopart.com/esdcan02-2bwy-stmicroelectronics-58631133; Ipc Land Pattern Name: SOT65P210X95-3; Temperature Range Low: -55°C; Capacitance: 3pF; Digikey Description: TVS DIODE 26.5V 44V SOT323-3; Automotive: Yes; ComponentLink2Description: Datasheet; Clamping Voltage: 44V; Manufacturer Part Number: ESDCAN02-2BWY; Lead Free: Yes; Package: SOT323-3L
D6 = CMP-2000-04993-2: DIODE GEN PURP 100V 150MA SOD123; Max Reverse Leakage Current: 5uA; Max Surge Current: 2A; Reverse Recovery Time: 4ns; Polarity: Standard; Capacitance: 4pF; Max Forward Surge Current (Ifsm): 1A; Element Configuration: Single; Power Dissipation: 400mW; Forward Voltage: 1V; Radiation Hardening: No; Lead Free: Lead Free; Max Reverse Voltage (DC): 100V; Current Rating: 150mA; Forward Current: 150mA; Packaging: Tape and Reel; Number of Pins: 2; Package Quantity: 3000; Max Operating Temperature: 150°C; Min Operating Temperature: -65°C; Average Rectified Current: 150mA; Recovery Time: 4ns; Output Current: 150mA; Peak Non-Repetitive Surge Current: 2A; Width: 1.8mm; Voltage Rating (DC): 100V; Height: 1.2mm; Max Repetitive Reverse Voltage (Vrrm): 100V; Mount: Surface Mount; Length: 2.85mm
D7-D9 = CMP-004-00034-2: Led, Red/Grn, 180Mcd/230Mcd, 624Nm/525Nm Rohs Compliant: Yes
FB1 = CMP-0686-00252-4: Chip Ferrite Bead, 0402, 600Ω @ 100MHz, 0.23Ω, 25%, 900mA; Number of Circuits: 1; Impedance: 600R; DC Resistance (DCR): 230mR; Material: Steel; Length: 1mm; Package Quantity: 10000; Height: 0.5mm; Width: 0.5mm; Max DC Current: 900mA; Number of Lines: 1; Termination: SMD/SMT; Packaging: Tape and Reel; Lead Free: Lead Free; Min Operating Temperature: -55°C; Max Operating Temperature: 125°C; Max Current Rating: 900mA; Case Code (Imperial): 0402; Number of Pins: 2; Current Rating: 900mA; Test Frequency: 100MHz; Case/Package: 0402; Tolerance: 25%; Case Code (Metric): 1005
J10 = CMP-002-00075-1: CONN HEADER SMD 10POS 1.27MM (specifically compatible with J-Link EDU cable) PN: 3220-10-0300-00
L2 = CMP-07251-000006-1: CMC 51UH 200MA 2LN 2KOHM SMD; Element Configuration: Dual; Number of Lines: 2; Core Material: Ferrite; Impedance: 2kR; Test Frequency: 100kHz; Voltage Rating (DC): 50V; Insulation Resistance: 10MR; Material: Steel; Tolerance: 50%; DC Resistance (DCR): 3.5R; RoHS Compliant: Yes; Mount: Surface Mount; REACH SVHC: No SVHC; Termination: SMD/SMT; DC Current: 200mA; Current: 200mA; Lead Free: Lead Free; Contact Plating: Tin; Length: 4.5mm; Max DC Current: 200mA; Width: 0.126inch; Case/Package: 4532; Packaging: Tape and Reel; Package Quantity: 1; Min Operating Temperature: -40°C; Depth: 3.4mm; Series: SRF4532; Max Operating Temperature: 125°C; Current Rating: 200mA; Self Resonant Frequency: 100kHz; Height: 0.118inch; Inductance: 51uH; Resistance: 2kR
LS2 = CMP-00027-00003-1: Audio Indicator 12V 12mA 110dBA 3.5KHz Resonant Frequency Thru-Hole
Q14 = CMP-35916-000009-1: MOSFET 2N-CH 60V 0.3A; Input Capacitance: 40pF; Continuous Drain Current (ID): 300mA; Max Power Dissipation: 285mW; FET Type: 2 N-Channel; Rds On Max: 1.5R; Mount: Surface Mount; Drain to Source Voltage (Vdss): 60V; Packaging: Tape and Reel
Q16 = CMP-1259-00116-1: Dual P-Channel Trench MOSFET, -50 V, -0.16 A, -55 to 150 degC, 6-Pin SOT363, Tape and Reel; Manufacturer: NXP Semiconductors; VGSth [typ] (V): -1.6; Automotive Qualified: Y; Channel Type: P; IDM [max] (A): -0.64; Packing: Tape & Reel; Mounting Technology: Surface Mount; PackageDescription: 6-Pin Small Outline Transistor Package, Body 2 x 1.25 mm, Pitch 0.65 mm; ComponentLink2URL: http://www.nxp.com/documents/data_sheet/BSS84AKS.pdf; ComponentLink3URL: http://www.nxp.com/documents/outline_drawing/sot363_po.pdf; PartNumber: BSS84AKS,115; PackageReference: SOT363; PackageVersion: 06-03-16, 03/2006; ComponentLink3Description: Package Specification; ComponentLink2Description: Datasheet; ComponentLink1Description: Manufacturer URL; VDS [max] (V): -50; Code_JEITA: SC-88; ID [max] (A): -0.16; DatasheetVersion: Rev. 1; ComponentLink1URL: http://www.nxp.com/
R10 R20 R27 R29 R36 R37 R45 R50 R51 R61 = CMP-1012-00623-3: Chip Resistor, 10 KOhm, +/- 1%, 0.1 W, -55 to 155 degC, 0603 (1608 Metric), RoHS, Tape and Reel; Manufacturer: Panasonic; Voltage Rating: 75V; Case\/Package: 0603; Power Rating: 100mW; Resistance: 10KOhm; Temperature Coefficient: 100ppm\/degreesC; Number of Pins: 2; Package Reference: 603; Depth: 0.8mm; Mount: SurfaceMount; Package Description: 2-Pin Surface Mount Device, Body 1.6 x 0.85 mm; Datasheet Version: 02/2017; Length: 1.6mm; Lead Free: LeadFree; Height: 0.45mm; Number of Terminations: 2; Max Power Dissipation: 100mW; Min Operating Temperature: -55degC; Datasheet URL: https://industrial.panasonic.com/cdbs/www-data/pdf/RDA0000/AOA0000C304.pdf; Termination: SMD/SMT; Case Code (Metric): 1608; Case Code (Imperial): 0603; Tolerance: 1%; Max Operating Temperature: 155degC; RoHSCompliant: true; Voltage Rating (DC): 75V; Radiation Hardening: No; Packaging: TapeandReel; Composition: ThickFilm; Mounting Technology: SurfaceMount; Manufacturer URL: http://www.panasonic.com/; Width: 0.031inch; REACH SVHC: NoSVHC; Contact Plating: Tin; Military Standard: Not; Package Quantity: 1
R19 R42 R44 = CMP-2000-00435-2: Chip Resistor, 330 Ohm, +/- 1%, 0.1 W, -55 to 155 degC, 0603 (1608 Metric), RoHS, Tape and Reel; Gender: Male; Mating Cycles: 10000; Current Rating: 500 mA; Voltage Rating: 10 V; REACH SVHC: No SVHC; PackageDescription: 2-Pin Surface Mount Device, Body 1.6 x 0.85 mm; Contact Finish: Gold; Pins: 8; ComponentLink1Description: Manufacturer URL; Packaging: Tape and Reel; Max Operating Temperature: 85 degC; Contact Material: Copper; Height: 1.45 mm; Width: 1.45 mm; DatasheetVersion: Apr-15; Package Quantity: 1500; Contact Plating: Gold; PackageReference: 0603; Mount: Surface Mount; Lead Pitch: 1.1 mm; Min Operating Temperature: -25 degC; ComponentLink1URL: http://www.panasonic.com/; ComponentLink2URL: http://industrial.panasonic.com/cdbs/www-data/pdf/RDA0000/AOA0000C86.pdf; Length: 13.7 mm; ComponentLink2Description: Datasheet; RoHSCompliant: true
R24-R26 R28 = CMP-009-00206-2: READ THE NAME
R30 R32 = CMP-1012-00372-3: RES SMD 60.4 OHM 1% 1/10W 0603; Resistance: 60.4R; Voltage Rating (DC): 50V; Voltage Rating: 75V; Temperature Coefficient: 100ppm/°C; Power Rating: 100mW; Mount: Surface Mount; Number of Terminations: 2; Max Operating Temperature: 155°C; Case Code (Metric): 1608; Height: 0.022inch; Case/Package: 0603; Min Operating Temperature: -55°C; REACH SVHC: No SVHC; Series: ERJ; Features: Automotive AEC-Q200; Military Standard: Not; Lead Free: Lead Free; Width: 0.031inch; Case Code (Imperial): 0603; Resistance Tolerance: 1%; Packaging: Tape and Reel; Termination: SMD/SMT; Tolerance: 1%; Contact Plating: Tin; Depth: 0.8mm; Resistor Type: Thick Film; Construction: Rectangular; RoHS Compliant: Yes; Max Power Dissipation: 100mW; Package Quantity: 1; Length: 1.6mm
R31 R38 R96 R102 = CMP-2000-00180-1: Manufacturer: Panasonic; Part Number: ERJ-3EKF1001V
R33-R35 R39 R40 R62 = CMP-2000-00572-1: Manufacturer: Panasonic; Part Number: ERJ3EKF56R0V
R43 = CMP-2000-00213-2: Chip Resistor, 120 Ohm, +/- 1%, 0.1 W, -55 to 155 degC, 0603 (1608 Metric), RoHS, Tape and Reel; Manufacturer: Panasonic; Power Rating: 100mW; Voltage Rating (DC): 75V; Resistance: 120Ohm; Temperature Coefficient: 100ppm/degreesC; Number of Terminations: 2; Military Standard: Not; Tolerance: 1%; Min Operating Temperature: -55degC; Packaging: TapeandReel; Lead Free: LeadFree; Max Operating Temperature: 155degC; Manufacturer URL: http://www.panasonic.com/; Case Code (Imperial): 0603; REACH SVHC: NoSVHC; Width: 0.031inch; Datasheet URL: https://industrial.panasonic.com/cdbs/www-data/pdf/RDA0000/AOA0000C283.pdf; RoHSCompliant: true; Max Power Dissipation: 100mW; Termination: SMD/SMT; Package Reference: 0603; Height: 0.022inch; Depth: 0.8mm; Package Description: 2-Pin Surface Mount Device, Body 1.6 x 0.85 mm; Contact Plating: Tin; Length: 1.6mm; Package URL: http://www.st.com/st-web-ui/static/active/en/resource/technical/document/datasheet/CD00001320.pdf; Radiation Hardening: No; Package Quantity: 1; Number of Pins: 2; Datasheet Version: 42095.0; Voltage Rating: 75V; Composition: ThickFilm; Case/Package: 0603; Mount: SurfaceMount; Case Code (Metric): 1608
SW1-SW3 = CMP-10040-000029-1: SWITCH TACTILE SPST-NO 0.02A 15V; Operating Force: 240gf; Switch Travel: 0.13mm; Illumination Type: Non-Illuminated; Throw Configuration: SPST; Number of Ports: 1; Current Rating: 5A; Mechanical Life: 500000Cycles; Switch Function: Off-Mom; Connector Type: USB; Actuator Type: Standard; Gender: Receptacle; Number of Contacts: 24; Contact Plating: Gold; Insulation Color: Black; Min Operating Temperature: -40°C; Packaging: Tape and Reel; Flammability Rating: UL94 V-0; Max Operating Temperature: 85°C; Termination: Solder; Mount: Surface Mount
TP1-TP6 = CMP-00028-00002-2: 0.6mm round; Pins: 1
U1 = CMP-12105-000107-1: IC MCU 32BIT 128KB FLASH 100LQFP
U2 = CMP-0054-00372-2: 8-Channel, 50 kSPS to 200 kSPS, 8-Bit A/D Converter, 16-pin TSSOP, Pb-Free; Manufacturer: National Semiconductor; PackageTopMarking: NSUZXYTT*88S022*CIMT; CompType: ADC IC; PowerWise: Y; ComponentLink2URL: http://www.national.com/pf/AD/ADC088S022.html; RoHS: Y; PackageDescription: Molded TSSOP, Jedec, 5 x 4.4 x 0.9mm Body, 16 Lead, 0.65mm Pitch; DatasheetVersion: Feb-2010; PinCount: 16; ComponentLink1Description: ADC088S022 Datasheet; Code_JEDEC: MO-153-AB; ComponentLink3URL: http://www.national.com/packaging/folders/mtc16.html; PackageVersion: revD, Jun-2003; ComponentLink3Description: MTC16 Package Page; RevisionNote: Component URLs added; ComponentLink1URL: http://www.national.com/ds/AD/ADC088S022.pdf; ComponentLink2Description: ADC088S022 Web Page; PackageReference: MTC16
U4 = CMP-015-00012-2: Automotive CAN FD transceiver with watchdog, bus diagnostics and partial networking via sele 14-SOT-23-THIN -40 to 150
U10 = CMP-12756-000009-1: IC REG LINEAR 5V 150MA SOT89; Manufacturer: Diodes Inc.; Output Type: Fixed; Min Supply Voltage: 3.3V; Max Junction Temp: +125°C; Max Supply Voltage: 40V; Nominal Supply Current: 2.5-25uA; Number Of Outputs: 1; Dropout Voltage: 1000mV; Manufacturer Part Number: AP7381-50Y-13; RoHS: TRUE; Digikey Description: IC REG LINEAR 5V 150MA SOT89; Output Voltage: 5V; Footprint Url: https://www.diodes.com/assets/Package-Files/SOT89.pdf; Category: IC; Temperature: -40°C to +125°C; ComponentLink2Description: Datasheet; Package: SOT89; Temperature Range Low: -40°C; Temperature Range High: +125°C; ComponentLink2URL: https://www.diodes.com/assets/Datasheets/AP7381.pdf; Device Class L1: Integrated Circuits (ICs); Automotive: No; Output Current: 150mA; Ambient Temperature Range High: +85°C; Octopart: https://octopart.com/ap7381-50y-13-diodes+inc.-87775116; Lead Free: Yes; Device Class L2: Power Management ICs; Height: 1.6mm; Device Class L3: Voltage Regulators - Linear; Ambient Temperature Range Low: -40°C
Y1 = CMP-27762-011708-1: Crystal 48MHz ±20ppm 18pF SMD-4 3.2mm x 2.5mm; Series Resistance: 35R; Frequency Stability: 50ppm; Package Quantity: 1000; Packaging: Tape and Reel; Mount: Surface Mount; Length: 3.2mm; Load Capacitance: 18pF; Max Operating Temperature: 70°C; Operating Frequency: 48 MHz; RoHS Compliant: Yes; Series: ABM8; Frequency Tolerance: 20ppm; Lead Free: Lead Free; Min Operating Temperature: -20°C; Case/Package: CSMD; Number of Pins: 4; Height: 0.031inch; ESR (Equivalent Series Resistance): 35R; Frequency: 48MHz; Radiation Hardening: No; Width: 0.098inch; Tolerance: 20ppm; Termination: SMD/SMT; Depth: 2.5mm; Resistor Type: Ceramic; REACH SVHC: No SVHC
Y2 = CMP-40224-000006-1: CRYSTAL 32.7680KHZ 12.5PF SMD; Manufacturer: ECS International; Frequency: 32.768kHz; Esr: 90kΩ; Tolerance: 20ppm; Device Class L1: Passive Components; Load Capacitance: 12.5pF; Temperature: -40°C to +85°C; ComponentLink2URL: https://ecsxtal.com/store/pdf/ECX-1210.pdf; Series: ECX-1210; Octopart: https://octopart.com/ecs-.327-12.5-1210-tr-ecs+international-81221340; ComponentLink2Description: Datasheet; Temperature Range Low: -40°C; Digikey Description: CRYSTAL 32.7680KHZ 12.5PF SMD; Lead Free: Yes; RoHS: TRUE; Device Class L3: Crystals; Automotive: No; Category: Crys; Height: 0.5mm; Manufacturer Part Number: ECS-.327-12.5-1210-TR; Temperature Range High: +85°C; Device Class L2: Crystals / Oscillators; Package: ECX-1210